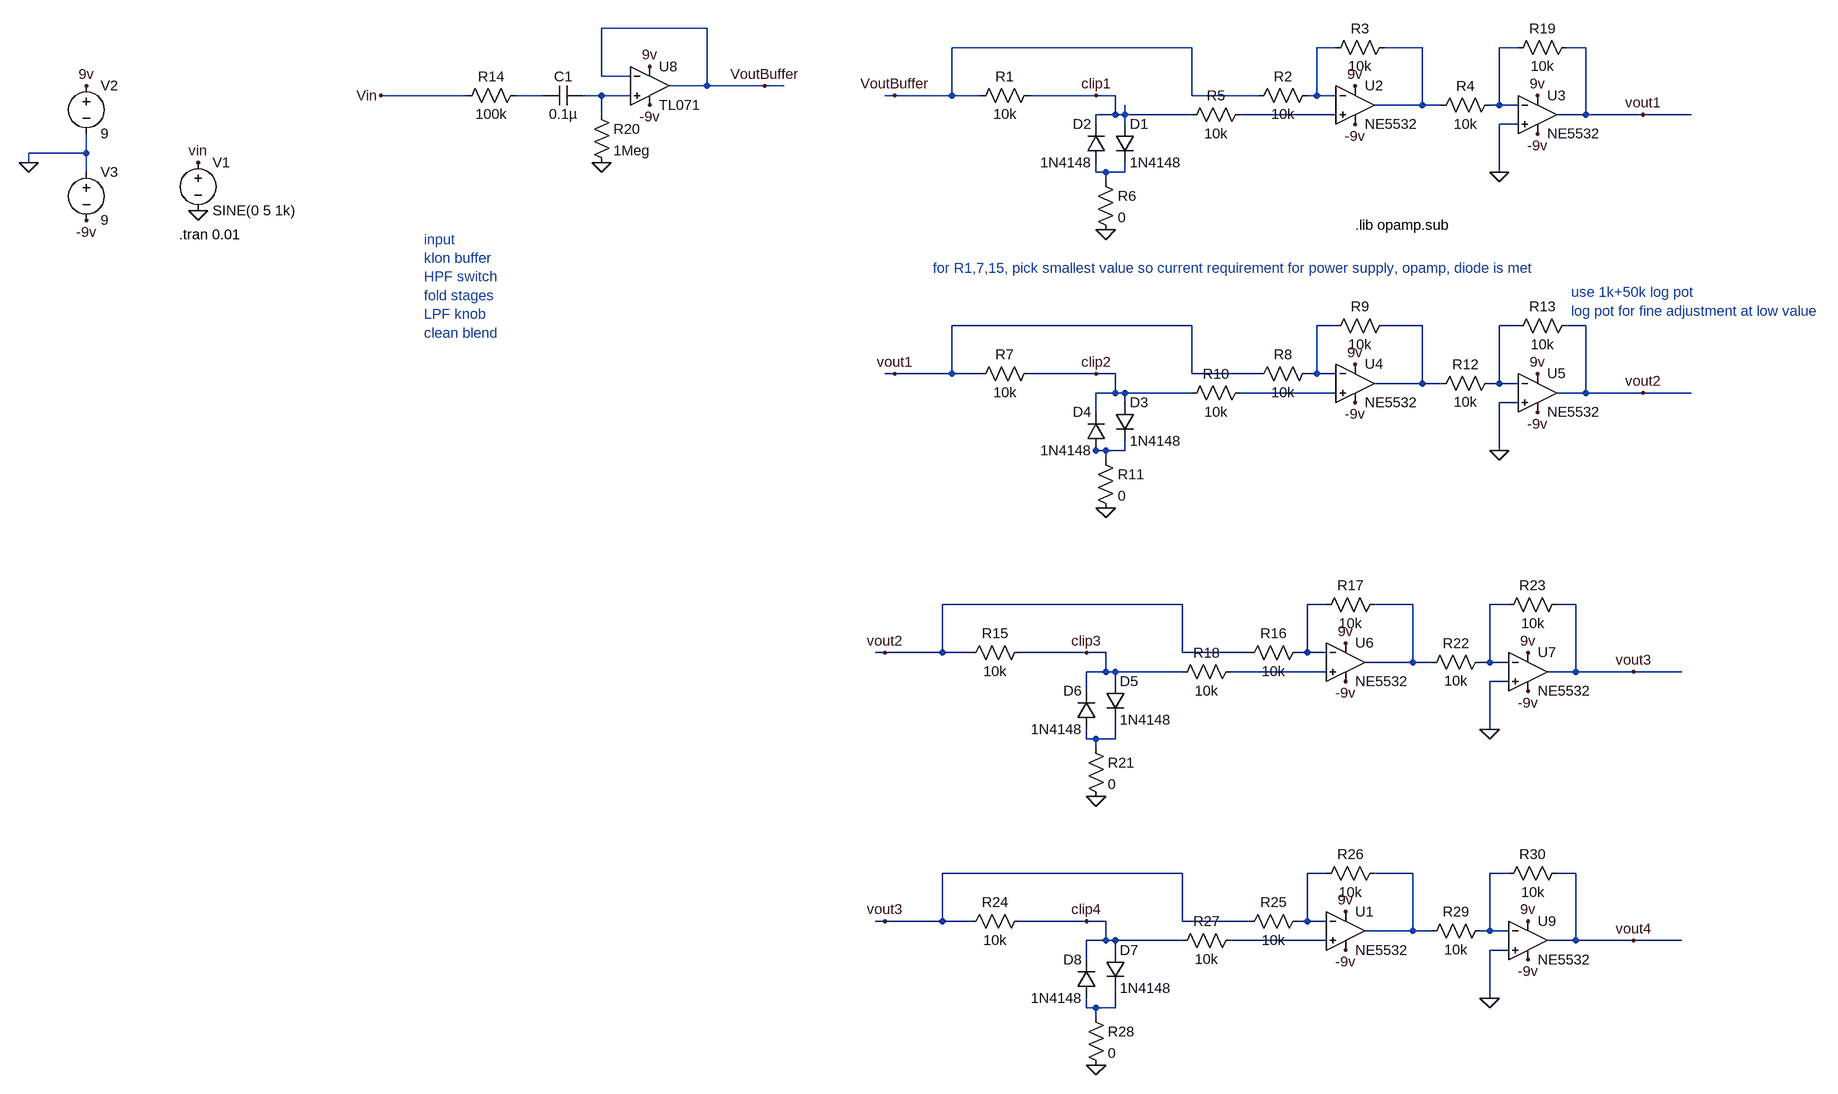
[diagram p0: schematic cascaded_wavefolder.asc]
cascaded_wavefolder.asc, the LTspice schematic file:
Version 4
SHEET 1 2644 1668
WIRE -1424 -96 -1600 -96
WIRE -384 -64 -784 -64
WIRE -144 -64 -176 -64
WIRE 0 -64 -64 -64
WIRE 160 -64 128 -64
WIRE 272 -64 240 -64
WIRE -1600 -16 -1600 -96
WIRE -1552 -16 -1600 -16
WIRE -1424 0 -1424 -96
WIRE -1424 0 -1488 0
WIRE -1328 0 -1424 0
WIRE -1296 0 -1328 0
WIRE -1824 16 -1968 16
WIRE -1696 16 -1744 16
WIRE -1600 16 -1632 16
WIRE -1552 16 -1600 16
WIRE -880 16 -896 16
WIRE -784 16 -784 -64
WIRE -784 16 -880 16
WIRE -736 16 -784 16
WIRE -544 16 -656 16
WIRE -512 16 -544 16
WIRE -384 16 -384 -64
WIRE -272 16 -384 16
WIRE -176 16 -176 -64
WIRE -176 16 -192 16
WIRE -144 16 -176 16
WIRE 0 32 0 -64
WIRE 0 32 -80 32
WIRE 32 32 0 32
WIRE 128 32 128 -64
WIRE 128 32 112 32
WIRE 160 32 128 32
WIRE -1600 48 -1600 16
WIRE -512 48 -512 16
WIRE -512 48 -544 48
WIRE -496 48 -496 32
WIRE -496 48 -512 48
WIRE -384 48 -496 48
WIRE -144 48 -304 48
WIRE 272 48 272 -64
WIRE 272 48 224 48
WIRE 368 48 272 48
WIRE 448 48 368 48
WIRE -544 64 -544 48
WIRE -496 64 -496 48
WIRE 160 64 128 64
WIRE -2704 112 -2704 80
WIRE -2704 112 -2800 112
WIRE -2800 128 -2800 112
WIRE -2704 144 -2704 112
WIRE -544 144 -544 128
WIRE -528 144 -544 144
WIRE -496 144 -496 128
WIRE -496 144 -528 144
WIRE 128 144 128 64
WIRE -528 160 -528 144
WIRE -384 400 -784 400
WIRE -144 400 -176 400
WIRE 0 400 -64 400
WIRE 160 400 128 400
WIRE 272 400 240 400
WIRE -880 480 -896 480
WIRE -784 480 -784 400
WIRE -784 480 -880 480
WIRE -736 480 -784 480
WIRE -544 480 -656 480
WIRE -512 480 -544 480
WIRE -384 480 -384 400
WIRE -272 480 -384 480
WIRE -176 480 -176 400
WIRE -176 480 -192 480
WIRE -144 480 -176 480
WIRE 0 496 0 400
WIRE 0 496 -80 496
WIRE 32 496 0 496
WIRE 128 496 128 400
WIRE 128 496 112 496
WIRE 160 496 128 496
WIRE -512 512 -512 480
WIRE -512 512 -544 512
WIRE -496 512 -512 512
WIRE -384 512 -496 512
WIRE -144 512 -304 512
WIRE 272 512 272 400
WIRE 272 512 224 512
WIRE 368 512 272 512
WIRE 448 512 368 512
WIRE -496 528 -496 512
WIRE 160 528 128 528
WIRE -544 544 -544 512
WIRE -544 608 -544 592
WIRE -528 608 -544 608
WIRE -496 608 -496 592
WIRE -496 608 -528 608
WIRE 128 608 128 528
WIRE -528 624 -528 608
WIRE -400 880 -800 880
WIRE -160 880 -192 880
WIRE -16 880 -80 880
WIRE 144 880 112 880
WIRE 256 880 224 880
WIRE -896 960 -912 960
WIRE -800 960 -800 880
WIRE -800 960 -896 960
WIRE -752 960 -800 960
WIRE -560 960 -672 960
WIRE -528 960 -560 960
WIRE -400 960 -400 880
WIRE -288 960 -400 960
WIRE -192 960 -192 880
WIRE -192 960 -208 960
WIRE -160 960 -192 960
WIRE -16 976 -16 880
WIRE -16 976 -96 976
WIRE 16 976 -16 976
WIRE 112 976 112 880
WIRE 112 976 96 976
WIRE 144 976 112 976
WIRE -528 992 -528 960
WIRE -528 992 -560 992
WIRE -512 992 -528 992
WIRE -400 992 -512 992
WIRE -160 992 -320 992
WIRE 256 992 256 880
WIRE 256 992 208 992
WIRE 352 992 256 992
WIRE 432 992 352 992
WIRE -512 1008 -512 992
WIRE 144 1008 112 1008
WIRE -560 1024 -560 992
WIRE 112 1088 112 1008
WIRE -560 1104 -560 1088
WIRE -544 1104 -560 1104
WIRE -512 1104 -512 1072
WIRE -512 1104 -544 1104
WIRE -544 1120 -544 1104
WIRE -400 1328 -800 1328
WIRE -160 1328 -192 1328
WIRE -16 1328 -80 1328
WIRE 144 1328 112 1328
WIRE 256 1328 224 1328
WIRE -896 1408 -912 1408
WIRE -800 1408 -800 1328
WIRE -800 1408 -896 1408
WIRE -752 1408 -800 1408
WIRE -560 1408 -672 1408
WIRE -528 1408 -560 1408
WIRE -400 1408 -400 1328
WIRE -288 1408 -400 1408
WIRE -192 1408 -192 1328
WIRE -192 1408 -208 1408
WIRE -160 1408 -192 1408
WIRE -16 1424 -16 1328
WIRE -16 1424 -96 1424
WIRE 16 1424 -16 1424
WIRE 112 1424 112 1328
WIRE 112 1424 96 1424
WIRE 144 1424 112 1424
WIRE -528 1440 -528 1408
WIRE -528 1440 -560 1440
WIRE -512 1440 -528 1440
WIRE -400 1440 -512 1440
WIRE -160 1440 -320 1440
WIRE 256 1440 256 1328
WIRE 256 1440 208 1440
WIRE 352 1440 256 1440
WIRE 432 1440 352 1440
WIRE -512 1456 -512 1440
WIRE 144 1456 112 1456
WIRE -560 1472 -560 1440
WIRE 112 1536 112 1456
WIRE -560 1552 -560 1536
WIRE -544 1552 -560 1552
WIRE -512 1552 -512 1520
WIRE -512 1552 -544 1552
WIRE -544 1568 -544 1552
FLAG -2336 208 0
FLAG -880 16 VoutBuffer
FLAG -544 16 clip1
FLAG -528 240 0
FLAG 128 144 0
FLAG -2336 128 vin
FLAG 368 48 vout1
FLAG -880 480 vout1
FLAG -544 480 clip2
FLAG -528 704 0
FLAG 128 608 0
FLAG 368 512 vout2
FLAG -896 960 vout2
FLAG -560 960 clip3
FLAG -544 1200 0
FLAG 112 1088 0
FLAG 352 992 vout3
FLAG -2800 128 0
FLAG -2704 224 -9v
FLAG -2704 0 9v
FLAG -112 0 9v
FLAG 192 16 9v
FLAG -112 464 9v
FLAG 192 480 9v
FLAG -128 944 9v
FLAG 176 960 9v
FLAG -1520 -32 9v
FLAG -1520 32 -9v
FLAG -112 64 -9v
FLAG 192 80 -9v
FLAG -112 528 -9v
FLAG 192 544 -9v
FLAG 176 1024 -9v
FLAG -128 1008 -9v
FLAG -1600 128 0
FLAG -1328 0 VoutBuffer
FLAG -1968 16 Vin
FLAG -896 1408 vout3
FLAG -560 1408 clip4
FLAG -544 1648 0
FLAG 112 1536 0
FLAG 352 1440 vout4
FLAG -128 1392 9v
FLAG 176 1408 9v
FLAG 176 1472 -9v
FLAG -128 1456 -9v
SYMBOL voltage -2336 112 R0
WINDOW 123 0 0 Left 0
WINDOW 39 0 0 Left 0
SYMATTR InstName V1
SYMATTR Value SINE(0 5 1k)
SYMBOL res -640 0 R90
WINDOW 0 0 56 VBottom 2
WINDOW 3 32 56 VTop 2
SYMATTR InstName R1
SYMATTR Value 10k
SYMBOL diode -512 64 R0
SYMATTR InstName D1
SYMATTR Value 1N4148
SYMBOL diode -528 128 R180
WINDOW 0 24 64 Left 2
WINDOW 3 24 0 Left 2
SYMATTR InstName D2
SYMATTR Value 1N4148
SYMBOL res -176 0 R90
WINDOW 0 0 56 VBottom 2
WINDOW 3 32 56 VTop 2
SYMATTR InstName R2
SYMATTR Value 10k
SYMBOL res -48 -80 R90
WINDOW 0 0 56 VBottom 2
WINDOW 3 32 56 VTop 2
SYMATTR InstName R3
SYMATTR Value 10k
SYMBOL res -288 32 R90
WINDOW 0 0 56 VBottom 2
WINDOW 3 32 56 VTop 2
SYMATTR InstName R5
SYMATTR Value 10k
SYMBOL res -544 144 R0
SYMATTR InstName R6
SYMATTR Value 0
SYMBOL res 128 16 R90
WINDOW 0 0 56 VBottom 2
WINDOW 3 32 56 VTop 2
SYMATTR InstName R4
SYMATTR Value 10k
SYMBOL res 256 -80 R90
WINDOW 0 0 56 VBottom 2
WINDOW 3 32 56 VTop 2
SYMATTR InstName R19
SYMATTR Value 10k
SYMBOL res -640 464 R90
WINDOW 0 0 56 VBottom 2
WINDOW 3 32 56 VTop 2
SYMATTR InstName R7
SYMATTR Value 10k
SYMBOL diode -512 528 R0
SYMATTR InstName D3
SYMATTR Value 1N4148
SYMBOL diode -528 608 R180
WINDOW 0 24 64 Left 2
WINDOW 3 24 0 Left 2
SYMATTR InstName D4
SYMATTR Value 1N4148
SYMBOL res -176 464 R90
WINDOW 0 0 56 VBottom 2
WINDOW 3 32 56 VTop 2
SYMATTR InstName R8
SYMATTR Value 10k
SYMBOL res -48 384 R90
WINDOW 0 0 56 VBottom 2
WINDOW 3 32 56 VTop 2
SYMATTR InstName R9
SYMATTR Value 10k
SYMBOL res -288 496 R90
WINDOW 0 0 56 VBottom 2
WINDOW 3 32 56 VTop 2
SYMATTR InstName R10
SYMATTR Value 10k
SYMBOL res -544 608 R0
SYMATTR InstName R11
SYMATTR Value 0
SYMBOL res 128 480 R90
WINDOW 0 0 56 VBottom 2
WINDOW 3 32 56 VTop 2
SYMATTR InstName R12
SYMATTR Value 10k
SYMBOL res 256 384 R90
WINDOW 0 0 56 VBottom 2
WINDOW 3 32 56 VTop 2
SYMATTR InstName R13
SYMATTR Value 10k
SYMBOL res -656 944 R90
WINDOW 0 0 56 VBottom 2
WINDOW 3 32 56 VTop 2
SYMATTR InstName R15
SYMATTR Value 10k
SYMBOL diode -528 1008 R0
SYMATTR InstName D5
SYMATTR Value 1N4148
SYMBOL diode -544 1088 R180
WINDOW 0 24 64 Left 2
WINDOW 3 24 0 Left 2
SYMATTR InstName D6
SYMATTR Value 1N4148
SYMBOL res -192 944 R90
WINDOW 0 0 56 VBottom 2
WINDOW 3 32 56 VTop 2
SYMATTR InstName R16
SYMATTR Value 10k
SYMBOL res -64 864 R90
WINDOW 0 0 56 VBottom 2
WINDOW 3 32 56 VTop 2
SYMATTR InstName R17
SYMATTR Value 10k
SYMBOL res -304 976 R90
WINDOW 0 0 56 VBottom 2
WINDOW 3 32 56 VTop 2
SYMATTR InstName R18
SYMATTR Value 10k
SYMBOL res -560 1104 R0
SYMATTR InstName R21
SYMATTR Value 0
SYMBOL res 112 960 R90
WINDOW 0 0 56 VBottom 2
WINDOW 3 32 56 VTop 2
SYMATTR InstName R22
SYMATTR Value 10k
SYMBOL res 240 864 R90
WINDOW 0 0 56 VBottom 2
WINDOW 3 32 56 VTop 2
SYMATTR InstName R23
SYMATTR Value 10k
SYMBOL EXTRA\\AudioOpamp\\TI\\NE5532 -112 32 R0
SYMATTR InstName U2
SYMBOL EXTRA\\AudioOpamp\\TI\\NE5532 192 48 R0
SYMATTR InstName U3
SYMBOL EXTRA\\AudioOpamp\\TI\\NE5532 -112 496 R0
SYMATTR InstName U4
SYMBOL EXTRA\\AudioOpamp\\TI\\NE5532 192 512 R0
SYMATTR InstName U5
SYMBOL EXTRA\\AudioOpamp\\TI\\NE5532 -128 976 R0
SYMATTR InstName U6
SYMBOL EXTRA\\AudioOpamp\\TI\\NE5532 176 992 R0
SYMATTR InstName U7
SYMBOL voltage -2704 -16 R0
WINDOW 123 0 0 Left 0
WINDOW 39 0 0 Left 0
SYMATTR InstName V2
SYMATTR Value 9
SYMBOL voltage -2704 128 R0
WINDOW 123 0 0 Left 0
WINDOW 39 0 0 Left 0
SYMATTR InstName V3
SYMATTR Value 9
SYMBOL res -1728 0 R90
WINDOW 0 0 56 VBottom 2
WINDOW 3 32 56 VTop 2
SYMATTR InstName R14
SYMATTR Value 100k
SYMBOL cap -1632 0 R90
WINDOW 0 0 32 VBottom 2
WINDOW 3 32 32 VTop 2
SYMATTR InstName C1
SYMATTR Value 0.1µ
SYMBOL res -1616 32 R0
SYMATTR InstName R20
SYMATTR Value 1Meg
SYMBOL EXTRA\\AudioOpamp\\TI\\TL071 -1520 0 R0
SYMATTR InstName U8
SYMBOL res -656 1392 R90
WINDOW 0 0 56 VBottom 2
WINDOW 3 32 56 VTop 2
SYMATTR InstName R24
SYMATTR Value 10k
SYMBOL diode -528 1456 R0
SYMATTR InstName D7
SYMATTR Value 1N4148
SYMBOL diode -544 1536 R180
WINDOW 0 24 64 Left 2
WINDOW 3 24 0 Left 2
SYMATTR InstName D8
SYMATTR Value 1N4148
SYMBOL res -192 1392 R90
WINDOW 0 0 56 VBottom 2
WINDOW 3 32 56 VTop 2
SYMATTR InstName R25
SYMATTR Value 10k
SYMBOL res -64 1312 R90
WINDOW 0 0 56 VBottom 2
WINDOW 3 32 56 VTop 2
SYMATTR InstName R26
SYMATTR Value 10k
SYMBOL res -304 1424 R90
WINDOW 0 0 56 VBottom 2
WINDOW 3 32 56 VTop 2
SYMATTR InstName R27
SYMATTR Value 10k
SYMBOL res -560 1552 R0
SYMATTR InstName R28
SYMATTR Value 0
SYMBOL res 112 1408 R90
WINDOW 0 0 56 VBottom 2
WINDOW 3 32 56 VTop 2
SYMATTR InstName R29
SYMATTR Value 10k
SYMBOL res 240 1312 R90
WINDOW 0 0 56 VBottom 2
WINDOW 3 32 56 VTop 2
SYMATTR InstName R30
SYMATTR Value 10k
SYMBOL EXTRA\\AudioOpamp\\TI\\NE5532 -128 1424 R0
SYMATTR InstName U1
SYMBOL EXTRA\\AudioOpamp\\TI\\NE5532 176 1440 R0
SYMATTR InstName U9
TEXT -2368 248 Left 2 !.tran 0.01
TEXT -112 232 Left 2 !.lib opamp.sub
TEXT -816 304 Left 2 ;for R1,7,15, pick smallest value so current requirement for power supply, opamp, diode is met
TEXT 248 344 Left 2 ;use 1k+50k log pot\nlog pot for fine adjustment at low value
TEXT -1896 256 Left 2 ;input\nklon buffer\nHPF switch\nfold stages\nLPF knob\nclean blend

The netlist it stands for:
* cascaded_wavefolder.asc
V1 vin 0 SINE(0 5 1k)
R1 clip1 VoutBuffer 10k
D1 clip1 N007 1N4148
D2 N007 clip1 1N4148
R2 N001 VoutBuffer 10k
R3 N002 N001 10k
R5 N006 clip1 10k
R6 N007 0 0
R4 N003 N002 10k
R19 vout1 N003 10k
R7 clip2 vout1 10k
D3 clip2 N012 1N4148
D4 N012 clip2 1N4148
R8 N008 vout1 10k
R9 N009 N008 10k
R10 N011 clip2 10k
R11 N012 0 0
R12 N010 N009 10k
R13 vout2 N010 10k
R15 clip3 vout2 10k
D5 clip3 N017 1N4148
D6 N017 clip3 1N4148
R16 N013 vout2 10k
R17 N014 N013 10k
R18 N016 clip3 10k
R21 N017 0 0
R22 N015 N014 10k
R23 vout3 N015 10k
XU2 N006 N001 9v -9v N002 NE5532  ; pins In+ In- V+ V- OUT
XU3 0 N003 9v -9v vout1 NE5532  ; pins In+ In- V+ V- OUT
XU4 N011 N008 9v -9v N009 NE5532  ; pins In+ In- V+ V- OUT
XU5 0 N010 9v -9v vout2 NE5532  ; pins In+ In- V+ V- OUT
XU6 N016 N013 9v -9v N014 NE5532  ; pins In+ In- V+ V- OUT
XU7 0 N015 9v -9v vout3 NE5532  ; pins In+ In- V+ V- OUT
V2 9v 0 9
V3 0 -9v 9
R14 N004 vin 100k
C1 N005 N004 0.1µ
R20 N005 0 1Meg
* U8: TL071 (symbol EXTRA\AudioOpamp\TI\TL071 not available, pins judged from their places): In+=N005 In-=VoutBuffer V+=9v V-=-9v OUT=VoutBuffer
R24 clip4 vout3 10k
D7 clip4 N022 1N4148
D8 N022 clip4 1N4148
R25 N018 vout3 10k
R26 N019 N018 10k
R27 N021 clip4 10k
R28 N022 0 0
R29 N020 N019 10k
R30 vout4 N020 10k
XU1 N021 N018 9v -9v N019 NE5532  ; pins In+ In- V+ V- OUT
XU9 0 N020 9v -9v vout4 NE5532  ; pins In+ In- V+ V- OUT
.model D D
.lib standard.dio
.tran 0.01
.lib opamp.sub
* for R1,7,15, pick smallest value so current requirement for power supply, opamp, diode is met
* use 1k+50k log pot
* log pot for fine adjustment at low value
* input
* klon buffer
* HPF switch
* fold stages
* LPF knob
* clean blend
.backanno
.end